# EAGLE board preparedinstruments_0_bechemel_v13_MOTHERBOARD_JLC_READY (EAGLE 9.6.2), part 1 of 2
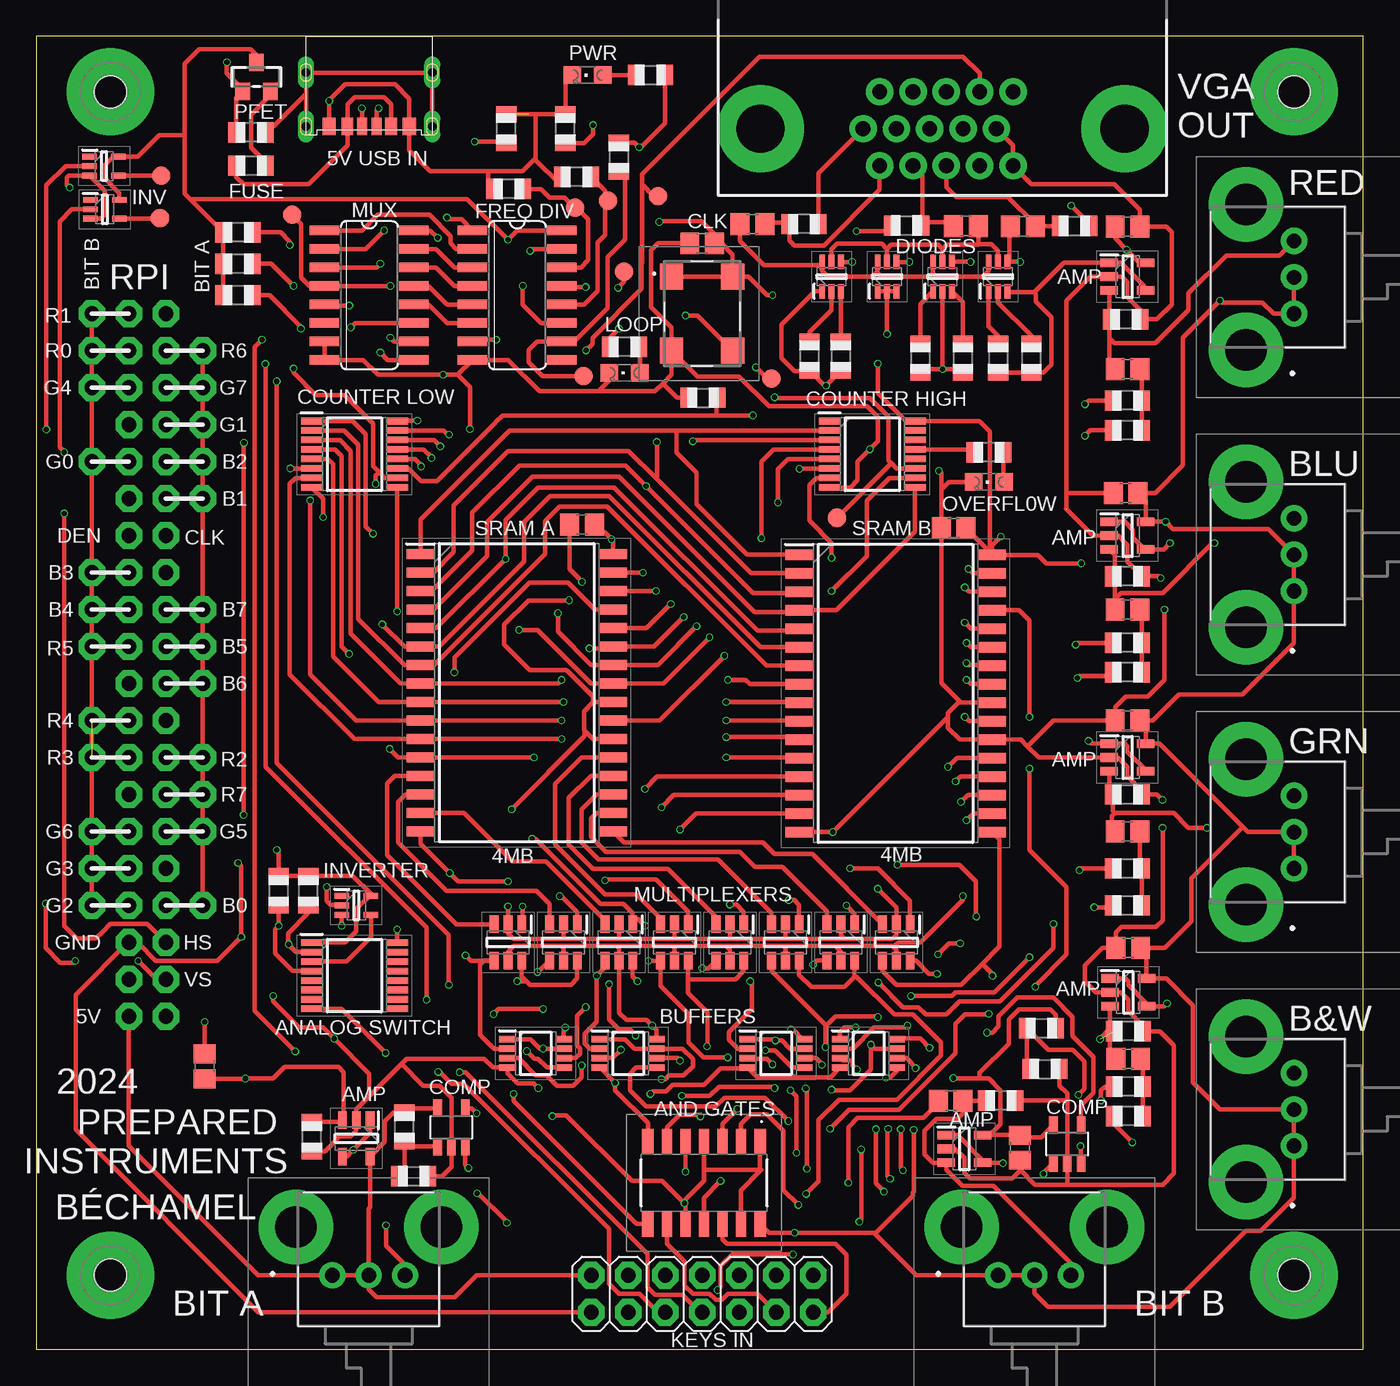
[diagram p5: board, top side]
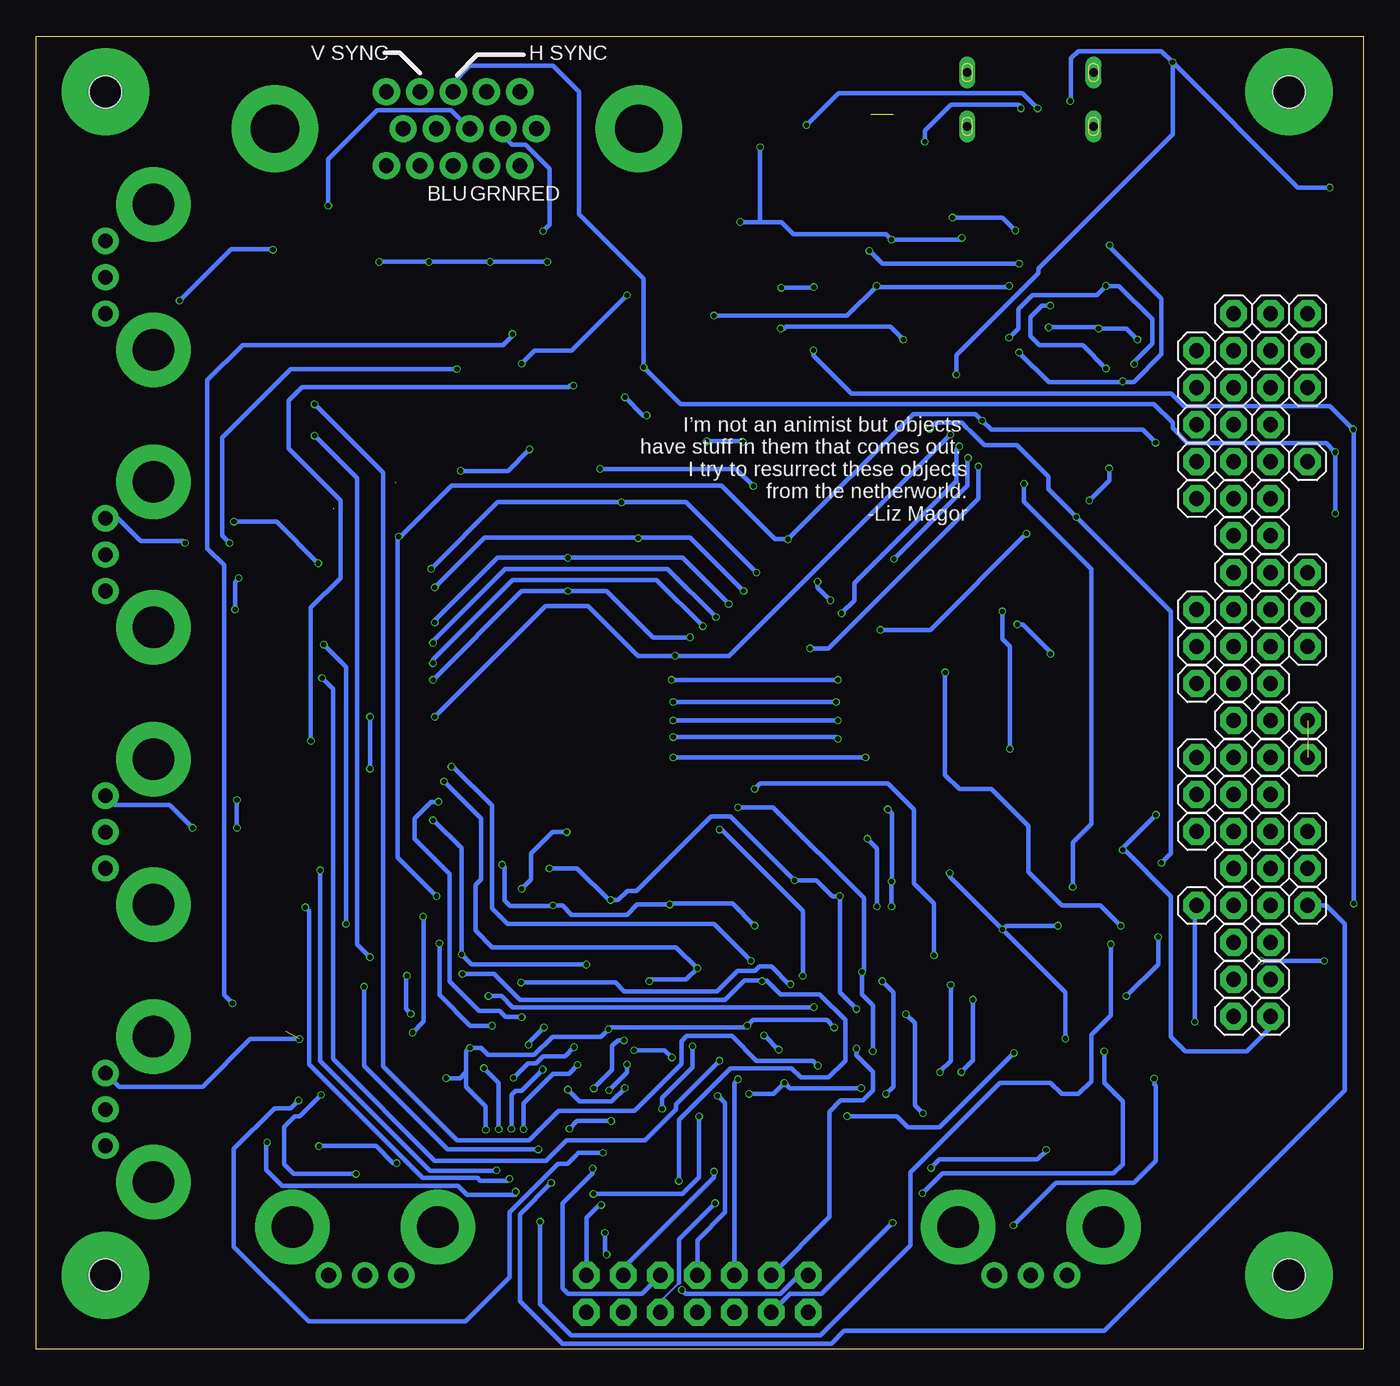
[diagram p6: board, bottom side, seen from below]

Size 91.11 x 90.16 mm. Coordinates in mm from the lower left corner, seen from the top.
Outline: 0,0 91.11,0 91.11,90.16 0,90.16 0,0
Copper layers (1*16): Top 0.035mm / dielectric 1.6mm / Bottom 0.035mm
Design rules "jlcpcb-2layers": minimum track width 5mil, minimum drill 0.3mm, track to track 5mil, track to pad 5mil, pad to pad 5mil, via to via 5mil, smd to smd 5mil, copper to edge 0.2mm, drill to drill 6mil, minimum pad ring 10mil, minimum via ring 3mil, stop-mask expansion 4mil, vias tented up to drill 0mil, thermal gap 10mil

## Footprints (pad centres in the part's own frame; a part is rotated, then mirrored left to right if it is on the bottom)
C0805 = smd 1.3 x 1.5: 1 -0.85,0; 2 0.85,0
SOT65P210X110-6N = smd 1 x 0.4: 1 -1,0.65; 2 -1,0; 3 -1,-0.65; 4 1,-0.65; 5 1,0; 6 1,0.65
R0805 = smd 1.1 x 1.4: 1 -1,0; 2 1,0
SOIC127P1412X305-32N = smd 1.922 x 0.7: 1 -6.614,9.525; 2 -6.614,8.255; 3 -6.614,6.985; 4 -6.614,5.715; 5 -6.614,4.445; 6 -6.614,3.175; 7 -6.614,1.905; 8 -6.614,0.635; 9 -6.614,-0.635; 10 -6.614,-1.905; 11 -6.614,-3.175; 12 -6.614,-4.445; 13 -6.614,-5.715; 14 -6.614,-6.985; 15 -6.614,-8.255; 16 -6.614,-9.525; 17 6.614,-9.525; 18 6.614,-8.255; 19 6.614,-6.985; 20 6.614,-5.715; 21 6.614,-4.445; 22 6.614,-3.175; 23 6.614,-1.905; 24 6.614,-0.635; 25 6.614,0.635; 26 6.614,1.905; 27 6.614,3.175; 28 6.614,4.445; 29 6.614,5.715; 30 6.614,6.985; 31 6.614,8.255; 32 6.614,9.525
SOP65P400X130-8N = smd 1.1 x 0.45: 1 -1.95,0.975; 2 -1.95,0.325; 3 -1.95,-0.325; 4 -1.95,-0.975; 5 1.95,-0.975; 6 1.95,-0.325; 7 1.95,0.325; 8 1.95,0.975
SOT95P280X145-6N = smd 1.2 x 0.6: 1 -1.25,0.95; 2 -1.25,0; 3 -1.25,-0.95; 4 1.25,-0.95; 5 1.25,0; 6 1.25,0.95
SOT95P280X145-5N = smd 1.2 x 0.6: 1 -1.25,0.95; 2 -1.25,0; 3 -1.25,-0.95; 4 1.25,-0.95; 5 1.25,0.95
SO16 = smd 0.66 x 2.032: 1 -4.445,-3.073; 2 -3.175,-3.073; 3 -1.905,-3.073; 4 -0.635,-3.073; 5 0.635,-3.073; 6 1.905,-3.073; 7 3.175,-3.073; 8 4.445,-3.073; 9 4.445,3.073; 10 3.175,3.073; 11 1.905,3.073; 12 0.635,3.073; 13 -0.635,3.073; 14 -1.905,3.073; 15 -3.175,3.073; 16 -4.445,3.073
74LVT08D118 = smd 0.8 x 1.75: 1 -3.86,-2.825; 7 3.86,-2.825; 8 3.86,2.825; 14 -3.86,2.825 | smd 0.7 x 1.75: 2 -2.54,-2.825; 3 -1.27,-2.825; 4 0,-2.825; 5 1.27,-2.825; 6 2.54,-2.825; 9 2.54,2.825; 10 1.27,2.825; 11 0,2.825; 12 -1.27,2.825; 13 -2.54,2.825
SOP65P640X110-16N = smd 1.475 x 0.45: 1 -2.938,2.275; 2 -2.938,1.625; 3 -2.938,0.975; 4 -2.938,0.325; 5 -2.938,-0.325; 6 -2.938,-0.975; 7 -2.938,-1.625; 8 -2.938,-2.275; 9 2.938,-2.275; 10 2.938,-1.625; 11 2.938,-0.975; 12 2.938,-0.325; 13 2.938,0.325; 14 2.938,0.975; 15 2.938,1.625; 16 2.938,2.275
DBV-R-PDSO-G5 = smd 0.6 x 1.2: 1 -0.95,-1.306; 2 0,-1.306; 3 0.95,-1.306; 4 0.95,1.306; 5 -0.95,1.306
1X01 = drill 1.016 octagon: 1 0,0
2X07 = drill 1.016 octagon: 1 -7.62,-1.27; 2 -7.62,1.27; 3 -5.08,-1.27; 4 -5.08,1.27; 5 -2.54,-1.27; 6 -2.54,1.27; 7 0,-1.27; 8 0,1.27; 9 2.54,-1.27; 10 2.54,1.27; 11 5.08,-1.27; 12 5.08,1.27; 13 7.62,-1.27; 14 7.62,1.27
CHIPLED_0805 = smd 1.2 x 1.2: A 0,-1.05; C 0,1.05
STANDOFF_HEX_FEMALE_400X2000_M2X0.4_MTGP600H220 = drill 2.2 pad 6: 1 0,0 | hole 2.2: 0,0
SOT23-WIDE = smd 1 x 1.2: 1 -0.95,-1; 2 0.95,-1; 3 0,1
SOP65P640X120-16N = smd 1.475 x 0.45: 1 -2.938,2.275; 2 -2.938,1.625; 3 -2.938,0.975; 4 -2.938,0.325; 5 -2.938,-0.325; 6 -2.938,-0.975; 7 -2.938,-1.625; 8 -2.938,-2.275; 9 2.938,-2.275; 10 2.938,-1.625; 11 2.938,-0.975; 12 2.938,-0.325; 13 2.938,0.325; 14 2.938,0.975; 15 2.938,1.625; 16 2.938,2.275
B1,27 = smd 1.27 x 1.27: TP 0,0
SOT65P210X110-5N = smd 1 x 0.4: 1 -1,0.65; 2 -1,0; 3 -1,-0.65; 4 1,-0.65; 5 1,0.65
DB15 = drill 1.016 pad 1.88: 1 -4.32,-7.62; 2 -2.03,-7.62; 3 0.26,-7.62; 4 2.55,-7.62; 5 4.84,-7.62; 6 -5.46,-5.08; 7 -3.17,-5.08; 8 -0.88,-5.08; 9 1.41,-5.08; 10 3.7,-5.08; 11 -4.32,-2.54; 12 -2.03,-2.54; 13 0.26,-2.54; 14 2.55,-2.54; 15 4.84,-2.54 | drill 3.302 pad 5.08: G1 -12.5,-5.08; G2 12.5,-5.08
USCX-06FX-XXMX-01 = smd 0.7 x 1.2: CC1 0.5,-1.75; CC2 -0.5,-1.75 | smd 0.9 x 1.2: GND1 2.75,-1.75; GND2 -2.75,-1.75 | drill 0.6 long: SHIELD1 4.325,1.95; SHIELD2 4.325,-1.75; SHIELD3 -4.35,-1.75; SHIELD4 -4.35,1.95 | smd 0.8 x 1.2: VBUS1 1.5,-1.75; VBUS2 -1.5,-1.75
PTV09A3015FB103 = drill 1 pad 1.5: 1 0,0; 2 2.5,0; 3 5,0 | drill 2.84 pad 4.3: MH1 -2.5,3.3; MH2 7.5,3.3
LFSPXO019137REEL = smd 1.8 x 1.6: 1 -2.54,-2.1; 2 2.54,-2.1; 3 2.54,2.1; 4 -2.54,2.1

## Placement (x,y rotation side)
C1  .1uF  [C0805]  45.72,75.95 180 top
C2  .1uF  [C0805]  74.93,50.8 180 top
C3  .1uF  [C0805]  49.17,77.27 0 top
C4  .1uF  [C0805]  62.79,17.07 0 top
C5  .1uF  [C0805]  63.83,77.14 180 top
C6  .1uF  [C0805]  67.74,77.11 0 top
C7  .1uF  [C0805]  37.47,56.64 180 top
C12  .1uF  [C0805]  11.56,19.43 270 top
C13  .1uF  [C0805]  74.93,77.09 180 top
C17  .1uF  [C0805]  62.99,56.39 0 top
C18  .1uF  [C0805]  74.98,27.56 0 top
C19  .1uF  [C0805]  67.54,13.84 90 top
C20  .1uF  [C0805]  74.93,43.18 0 top
C21  .1uF  [C0805]  74.8,58.8 0 top
C22  .1uF  [C0805]  74.93,35.56 180 top
C23  .1uF  [C0805]  74.98,19.94 180 top
C24  .1uF  [C0805]  74.93,67.31 180 top
D1  BAS16HTWQ-13  [SOT65P210X110-6N]  66.04,73.66 90 top
D2  BAS16HTWQ-13  [SOT65P210X110-6N]  54.61,73.66 90 top
D3  BAS16HTWQ-13  [SOT65P210X110-6N]  62.23,73.66 90 top
D4  BAS16HTWQ-13  [SOT65P210X110-6N]  58.42,73.66 90 top
FUSE  FUSE  [R0805]  14.73,81.28 180 top
IC1  IS61C5128AS-25QLI  [SOIC127P1412X305-32N]  59.01,45.04 0 top
IC2  74LVC2G125DCTRE6  [SOP65P400X130-8N]  34.29,20.32 0 top
IC3  74LVC2G125DCTRE6  [SOP65P400X130-8N]  40.64,20.32 0 top
IC4  74LVC2G125DCTRE6  [SOP65P400X130-8N]  57.15,20.32 0 top
IC5  SN74LVC1G3157DBVR  [SOT95P280X145-6N]  43.81,27.94 270 top
IC6  SN74LVC1G3157DBVR  [SOT95P280X145-6N]  47.62,27.94 270 top
IC7  SN74LVC1G3157DBVR  [SOT95P280X145-6N]  51.44,27.94 270 top
IC8  SN74LVC1G3157DBVR  [SOT95P280X145-6N]  55.24,27.94 270 top
IC9  SN74LVC1G3157DBVR  [SOT95P280X145-6N]  59.05,27.94 270 top
IC10  SN74LVC1G3157DBVR  [SOT95P280X145-6N]  40.01,27.94 270 top
IC11  SN74LVC1G3157DBVR  [SOT95P280X145-6N]  36.2,27.94 270 top
IC12  SN74LVC1G3157DBVR  [SOT95P280X145-6N]  32.38,27.94 270 top
IC13  THS4221DBVTG4  [SOT95P280X145-5N]  74.93,55.88 0 top
IC14  74AC151D  [SO16]  22.86,72.39 270 top
IC15  THS4221DBVTG4  [SOT95P280X145-5N]  74.93,73.66 0 top
IC16  74LVT08D,118  [74LVT08D118]  45.85,11.43 180 top
IC17  74AC590D  [SO16]  33.02,72.39 270 top
IC18  74HC4040PW,118  [SOP65P640X110-16N]  21.84,61.47 0 top
IC19  74HC4040PW,118  [SOP65P640X110-16N]  57.4,61.47 0 top
IC20  74LVC2G125DCTRE6  [SOP65P400X130-8N]  50.8,20.32 0 top
IC21  THS4221DBVTG4  [SOT95P280X145-5N]  74.93,40.64 0 top
IC22  THS4221DBVTG4  [SOT95P280X145-5N]  21.97,14.48 270 top
IC23  IS61C5128AS-25QLI  [SOIC127P1412X305-32N]  32.99,45.09 0 top
IC24  THS4221DBVTG4  [SOT95P280X145-5N]  63.73,13.77 0 top
IC25  TC75S57F  [DBV-R-PDSO-G5]  70.79,14.1 0 top
IC26  THS4221DBVTG4  [SOT95P280X145-5N]  74.98,24.51 0 top
IC27  TC75S57F  [DBV-R-PDSO-G5]  28.5,15.24 0 top
JP1  [1X01]  11.43,48.26 180 bottom
JP2  [1X01]  3.81,40.64 180 bottom
JP3  [1X01]  11.43,30.48 180 bottom
JP4  [1X01]  11.43,35.56 180 bottom
JP5  [1X01]  11.43,38.1 180 bottom
JP6  [1X01]  11.43,40.64 180 bottom
JP7  [1X01]  11.43,45.72 180 bottom
JP8  [1X01]  11.43,58.42 180 bottom
JP9  [1X01]  11.43,50.8 180 bottom
JP10  [1X01]  11.43,60.96 180 bottom
JP11  [1X01]  11.43,63.5 180 bottom
JP12  [1X01]  11.43,66.04 180 bottom
JP13  [1X01]  11.43,68.58 180 bottom
JP14  [1X01]  3.81,30.48 180 bottom
JP15  [1X01]  3.81,48.26 180 bottom
JP16  [1X01]  3.81,66.04 180 bottom
JP17  [1X01]  3.81,33.02 180 bottom
JP18  [1X01]  3.81,50.8 180 bottom
JP19  [1X01]  3.81,68.58 180 bottom
JP20  [1X01]  3.81,35.56 180 bottom
JP21  [1X01]  3.81,53.34 180 bottom
JP22  [1X01]  3.81,71.12 180 bottom
JP23  [1X01]  3.81,43.18 180 bottom
JP24  [1X01]  3.81,60.96 180 bottom
JP25  [1X01]  8.89,71.12 180 bottom
JP26  [1X01]  6.35,71.12 180 bottom
JP27  [1X01]  8.89,68.58 180 bottom
JP28  [1X01]  6.35,68.58 180 bottom
JP29  [1X01]  8.89,66.04 180 bottom
JP30  [1X01]  6.35,66.04 180 bottom
JP31  [1X01]  8.89,63.5 180 bottom
JP32  [1X01]  6.35,63.5 180 bottom
JP33  [1X01]  8.89,60.96 180 bottom
JP34  [1X01]  6.35,60.96 180 bottom
JP35  [1X01]  8.89,58.42 180 bottom
JP36  [1X01]  6.35,58.42 180 bottom
JP37  [1X01]  6.35,55.88 180 bottom
JP38  [1X01]  8.89,55.88 180 bottom
JP39  [1X01]  8.89,53.34 180 bottom
JP40  [1X01]  6.35,53.34 180 bottom
JP41  [1X01]  8.89,43.18 180 bottom
JP42  [1X01]  6.35,48.26 180 bottom
JP43  [1X01]  6.35,50.8 180 bottom
JP44  [1X01]  8.89,50.8 180 bottom
JP45  [1X01]  6.35,43.18 180 bottom
JP46  [1X01]  6.35,45.72 180 bottom
JP47  [1X01]  8.89,45.72 180 bottom
JP48  [1X01]  8.89,48.26 180 bottom
JP49  [1X01]  8.89,40.64 180 bottom
JP50  [1X01]  8.89,38.1 180 bottom
JP51  [1X01]  8.89,35.56 180 bottom
JP52  [1X01]  8.89,33.02 180 bottom
JP53  [1X01]  6.35,40.64 180 bottom
JP54  [1X01]  6.35,38.1 180 bottom
JP55  [1X01]  6.35,35.56 180 bottom
JP56  [1X01]  6.35,33.02 180 bottom
JP57  [1X01]  6.35,22.86 180 bottom
JP58  [1X01]  8.89,22.86 180 bottom
JP59  [1X01]  8.89,25.4 180 bottom
JP60  [1X01]  6.35,25.4 180 bottom
JP61  [1X01]  8.89,27.94 180 bottom
JP62  [1X01]  6.35,27.94 180 bottom
JP63  [1X01]  8.89,30.48 180 bottom
JP64  [1X01]  6.35,30.48 180 bottom
JP65  [2X07]  45.72,3.81 0 top
LED1  [CHIPLED_0805]  65.41,59.56 90 top
LED2  [CHIPLED_0805]  40.39,67.06 90 top
LED6  [CHIPLED_0805]  37.85,87.5 90 top
MP1  STANDOFF_F/F_M2_20MM  [STANDOFF_HEX_FEMALE_400X2000_M2X0.4_MTGP600H220]  86.36,5.08 0 top
MP2  STANDOFF_F/F_M2_20MM  [STANDOFF_HEX_FEMALE_400X2000_M2X0.4_MTGP600H220]  86.36,86.36 0 top
MP3  STANDOFF_F/F_M2_20MM  [STANDOFF_HEX_FEMALE_400X2000_M2X0.4_MTGP600H220]  5.08,5.08 0 top
MP4  STANDOFF_F/F_M2_20MM  [STANDOFF_HEX_FEMALE_400X2000_M2X0.4_MTGP600H220]  5.08,86.36 0 top
P-FET2  [SOT23-WIDE]  15.11,87.38 0 top
R1  5K  [R0805]  74.93,53.09 180 top
R2  5K  [R0805]  74.93,38.1 180 top
R3  5K  [R0805]  74.8,70.74 180 top
R4  10K  [R0805]  13.84,72.39 180 top
R5  10K  [R0805]  16.64,31.5 90 top
R6  75ohm  [R0805]  52.7,77.27 180 top
R7  1K  [R0805]  74.93,65.15 180 top
R8  2K  [R0805]  74.93,63.12 180 top
R9  1K  [R0805]  74.93,48.51 180 top
R10  2K  [R0805]  74.93,46.48 180 top
R11  10K  [R0805]  18.67,31.5 90 top
R12  180ohm  [R0805]  65.41,61.59 180 top
R13  10K  [R0805]  13.84,76.71 180 top
R14  ??  [R0805]  66.04,68.07 270 top
R15  180ohm  [R0805]  40.39,68.83 180 top
R16  1K  [R0805]  74.93,30.48 180 top
R17  2K  [R0805]  74.93,33.02 180 top
R18  10K  [R0805]  13.84,74.55 180 top
R19  1K  [R0805]  74.98,18.03 180 top
R20  2K  [R0805]  74.98,16 180 top
R21  5K  [R0805]  18.92,14.61 90 top
R22  5K  [R0805]  66.22,17.07 180 top
R23  ??  [R0805]  63.63,68.07 270 top
R24  ??  [R0805]  55.24,68.2 270 top
R25  ??  [R0805]  68.33,68.07 270 top
R26  ??  [R0805]  60.71,68.07 270 top
R27  ??  [R0805]  53.09,68.2 270 top
R28  5K  [R0805]  74.98,21.84 180 top
R29  75ohm  [R0805]  59.77,77.17 0 top
R30  300 ohm  [R0805]  42.16,87.5 0 top
R31  75ohm  [R0805]  71.3,77.14 0 top
R32  5K  [R0805]  69.01,22.05 0 top
R33  5K  [R0805]  69.27,19.25 0 top
R34  5K  [R0805]  25.27,15.27 90 top
R35  5K  [R0805]  25.91,11.89 0 top
R36  10K  [R0805]  37.08,80.52 180 top
R37  10K  [R0805]  40.01,81.86 270 top
R38  10K  [R0805]  32.44,79.68 180 top
R39  10K  [R0805]  45.77,65.35 0 top
R42  1M  [R0805]  14.73,83.57 180 top
R43  5k1  [R0805]  36.32,83.82 90 top
R44  5k1  [R0805]  32.26,83.82 90 top
S1  ADG888YRUZ-REEL7  [SOP65P640X120-16N]  21.84,25.65 0 top
TP1  TPB1,27  [B1,27]  40.36,74.02 0 top
TP2  TPB1,27  [B1,27]  50.5,66.65 0 top
TP3  TPB1,27  [B1,27]  39.24,78.87 0 top
TP4  TPB1,27  [B1,27]  42.7,79.2 0 top
TP5  TPB1,27  [B1,27]  37.57,66.83 0 top
TP6  TPB1,27  [B1,27]  17.55,77.9 0 top
TP7  TPB1,27  [B1,27]  36.98,78.38 90 top
TP8  TPB1,27  [B1,27]  8.59,80.59 0 top
TP9  TPB1,27  [B1,27]  8.48,77.67 0 top
TP10  TPB1,27  [B1,27]  54.97,57.1 0 top
U1  74AHCT1G04SE-7  [SOT65P210X110-5N]  21.97,30.48 0 top
U2  74AHCT1G04SE-7  [SOT65P210X110-5N]  4.65,81.25 0 top
U3  74AHCT1G04SE-7  [SOT65P210X110-5N]  4.7,78.28 0 top
U$1  DB15  [DB15]  62.23,88.9 0 top
U$2  USBC-6P  [USCX-06FX-XXMX-01]  22.86,85.72 0 top
VR1  PTV09A-3015F-B103  [PTV09A3015FB103]  20.32,5.08 0 top
VR2  PTV09A-3015F-B103  [PTV09A3015FB103]  86.36,52.07 90 top
VR4  PTV09A-3015F-B103  [PTV09A3015FB103]  86.36,33.02 90 top
VR5  PTV09A-3015F-B103  [PTV09A3015FB103]  86.36,13.97 90 top
VR6  PTV09A-3015F-B103  [PTV09A3015FB103]  66.04,5.08 0 top
VR7  PTV09A-3015F-B103  [PTV09A3015FB103]  86.36,71.12 90 top
Y1  LFSPXO019137REEL  [LFSPXO019137REEL]  45.72,71.12 270 top